# EasyEDA Pro project ProPrj_CWATCH_2025-07-30.epro, board PCB4
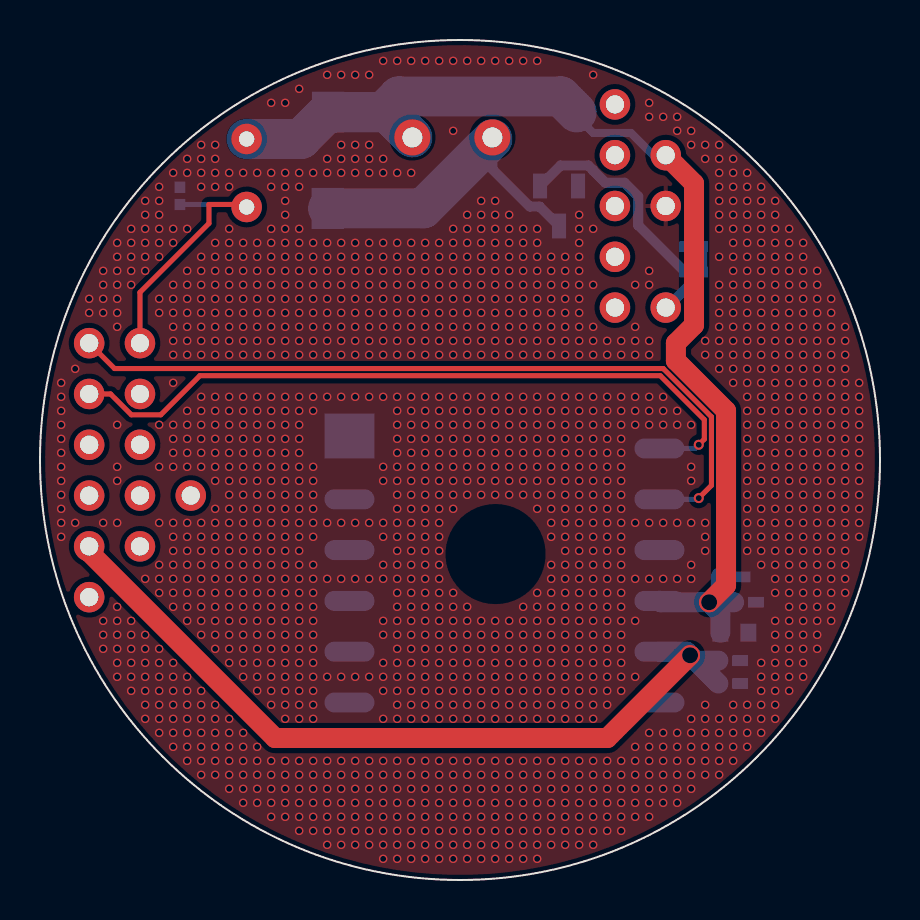
[diagram p7: board, top side]
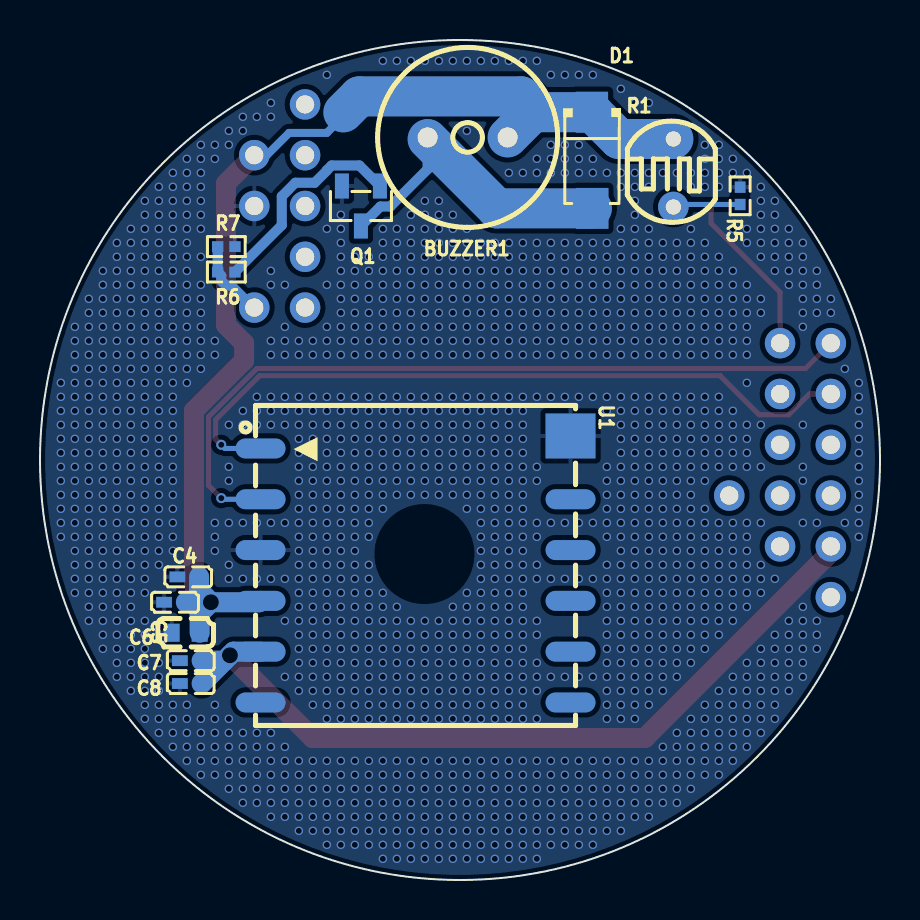
[diagram p8: board, bottom side, seen from below]

Outline 42 x 42 mm; copper layers: Top Layer, Bottom Layer. Coordinates in mm from the lower left corner of the outline.
Outline path: circle c21,21 r21
Stack: Top Layer 0.035mm / Dielectric1 1.51mm FR4 er 4.5 / Bottom Layer 0.035mm

## Design rules (mm)
template: Custom Config
spacing copperThickness1oz (default): track to track 0.102, other pairs 0.152 to 0.3
spacing copperThickness2oz: track to track 0.203, other pairs 0.152 to 0.3
track width copperThickness1oz (default): min 0.127, default 0.254, max 2.54
track width copperThickness2oz: min 0.203, default 0.254, max 2.54
differential pair differentialPair (default): width min 0.127, default 0.254, max 2.54; gap min 0.152, default 0.152
via viaSize (default): diameter min 0.4, default 0.5, max 10; hole min 0.3, default 0.305, max 6.3

## Placement (name value [footprint] x y rotation side)
BUZZER1  2.7kHz  [BUZ-TH_BD9.0-P4.00-D0.6-FD]  20.62 37.13 0 bottom
C4  1uF  [C0402]  34.59 15.16 180 bottom
C5  100nF  [C0402]  35.25 13.89 180 bottom
C6  10uF  [C0603]  34.72 12.36 180 bottom
C7  100nF  [C0402]  34.46 10.97 180 bottom
C8  4.7uF  [C0402]  34.46 9.82 180 bottom
D1  SS16  [SMA_L4.3-W2.6-LS5.0-RD]  14.4 35.99 270 bottom
NOREF  -  [Pad_e10]  2.46 19.22 0 top
NOREF#2  -  [Pad_e19]  28.75 33.7 0 top
NOREF#3  -  [Pad_e18]  28.75 31.16 0 top
NOREF#4  -  [Pad_e15]  5 21.76 0 top
NOREF#5  -  [Pad_e14]  5 19.22 0 top
NOREF#6  -  [Pad_e12]  2.46 14.14 0 top
NOREF#7  -  [Pad_e11]  2.46 16.68 0 top
NOREF#8  -  [Pad_e7]  2.46 26.84 0 top
NOREF#9  -  [Pad_e26]  31.29 28.62 0 top
NOREF#10  -  [Pad_e13]  5 16.68 0 top
NOREF#11  -  [Pad_e20]  28.75 36.24 0 top
NOREF#12  -  [Pad_e23]  31.29 33.7 0 top
NOREF#13  -  [Pad_e285]  5 26.84 0 top
NOREF#14  -  [Pad_e22]  31.29 36.24 0 top
NOREF#15  -  [Pad_e17]  28.75 28.62 0 top
NOREF#16  -  [Pad_e9]  2.46 21.76 0 top
NOREF#17  -  [Pad_e16]  5 24.3 0 top
NOREF#18  -  [Pad_e21]  28.75 38.78 0 top
NOREF#19  -  [Pad_e8]  2.46 24.3 0 top
NOREF#20  -  [Pad_e815]  7.54 19.22 0 top
Q1  SS8050(RANGE:200-350)  [SOT-23-3_L2.9-W1.3-P1.90-LS2.4-BR]  25.95 33.7 90 bottom
R1  GL5528  [RES-TH_L5.1-W4.3-P3.40-D0.5]  10.33 35.35 180 bottom
R5  10kΩ  [R0402]  6.99 34.21 90 bottom
R6  2.2kΩ  [R0402]  32.68 30.4 180 bottom
R7  10kΩ  [R0402]  32.68 31.67 180 bottom
U1  L80RE-M37  [GPSM-SMD_12P-L16.0-W16.0-P2.54-BL]  23.22 15.54 270 bottom

## Footprints (pads in the part's own frame, mm; a bottom-side part is the same pattern mirrored in y, then rotated)
BUZ-TH_BD9.0-P4.00-D0.6-FD
  round 1.8 hole 1: 1(-2,0) 2(2,0)
C0402
  rect 0.79x0.54 smd: 1(-0.545,0) 2(0.545,0)
C0603
  rect 0.8x0.9 smd: 1(-0.7,0) 2(0.7,0)
GPSM-SMD_12P-L16.0-W16.0-P2.54-BL
  oval 1x2.5 smd: 1(-6.037,-7.75) 2(-3.498,-7.75) 3(-0.958,-7.75) 4(1.583,-7.75) 5(4.122,-7.75) 6(6.662,-7.75) 7(6.662,7.75) 8(4.122,7.75) 9(1.583,7.75) 10(-0.958,7.75) 11(-3.498,7.75)
  rect 2.25x2.5 smd: 12(-6.662,7.75)
Pad_e7
  round 1.524 hole 0.914: 1(0,0)
Pad_e8
  round 1.524 hole 0.914: 2(0,0)
Pad_e9
  round 1.524 hole 0.914: 3(0,0)
Pad_e10
  round 1.524 hole 0.914: 4(0,0)
Pad_e11
  round 1.524 hole 0.914: 5(0,0)
Pad_e12
  round 1.524 hole 0.914: 6(0,0)
Pad_e13
  round 1.524 hole 0.914: 10(0,0)
Pad_e14
  round 1.524 hole 0.914: 9(0,0)
Pad_e15
  round 1.524 hole 0.914: 8(0,0)
Pad_e16
  round 1.524 hole 0.914: 7(0,0)
Pad_e17
  round 1.524 hole 0.914: 5(0,0)
Pad_e18
  round 1.524 hole 0.914: 4(0,0)
Pad_e19
  round 1.524 hole 0.914: 3(0,0)
Pad_e20
  round 1.524 hole 0.914: 2(0,0)
Pad_e21
  round 1.524 hole 0.914: 1(0,0)
Pad_e22
  round 1.524 hole 0.914: 6(0,0)
Pad_e23
  round 1.524 hole 0.914: 8(0,0)
Pad_e26
  round 1.524 hole 0.914: 5(0,0)
Pad_e285
  round 1.524 hole 0.914: 7(0,0)
Pad_e815
  round 1.524 hole 0.914: 9(0,0)
R0402
  rect 0.566x0.54 smd: 1(-0.433,0) 2(0.433,0)
RES-TH_L5.1-W4.3-P3.40-D0.5
  round 1.524 hole 0.762: 1(0,1.7) 2(0,-1.7)
SMA_L4.3-W2.6-LS5.0-RD
  rect 2.046x1.62 smd: 1(-2.404,-0.009) 2(2.404,0.009)
SOT-23-3_L2.9-W1.3-P1.90-LS2.4-BR
  rect 1.25x0.7 smd: 1(1,-0.95) 2(1,0.95) 3(-1,0)

## Nets
3.3V: BUZZER1.1 C4.2 C5.2 C6.2 D1.1 NOREF#14.6 R1.1 U1.4
GND: C4.1 C5.1 C6.1 C7.1 C8.1 NOREF#12.8 Q1.2 R5.2 R7.2 U1.3 U1.12
PGND: NOREF#6.6
BAT: C7.2 C8.2 NOREF#7.5 U1.5
BLA: NOREF#17.7
CSO: NOREF#3.4
DC: NOREF#15.5
IO4: NOREF#13.7 R1.2 R5.1
IO15: NOREF#9.5 R6.1 R7.1
IO16: NOREF#8.1 U1.2
IO17: NOREF#19.2 U1.1
IO35: NOREF#20.9
L_RST: NOREF#4.8
MISO: NOREF#18.1
MOSI: NOREF#11.2
SCK: NOREF#2.3
SCL: NOREF#10.10
SDA: NOREF#5.9
TP_INT: NOREF.4
TP_RST: NOREF#16.3
$1N970: BUZZER1.2 D1.2 Q1.3
$1N1589: Q1.1 R6.2

Pads without a net: U1 6 7 8 9 10 11

## Via types
v1: diameter 0.42, hole 0.3, Top Layer to Bottom Layer, 1648 vias
v2: diameter 0.5, hole 0.305, Top Layer to Bottom Layer, 2 vias
v3: diameter 1, hole 0.8, Top Layer to Bottom Layer, 2 vias

## Routing (per net, layer and track width the routed paths; a pad name or vN(x,y) marks a point on that pad's centre or on a via; arc(x,y) is an arc through that point)
3.3V: length 56.9
  Top Layer w1: v3(33.46,13.89) 34.3,14.73 34.3,23.46 31.79,25.97 31.79,26.84 32.7,27.75 32.7,34.83 NOREF#14.6
  Bottom Layer w0.4: 26.83,38.38 26.83,38.18 27.66,37.35 29.55,37.35 30.66,36.24 NOREF#14.6
  Bottom Layer w1: v3(33.46,13.89) 34.04,14.48 C4.2 ; v3(33.46,13.89) 34.02,13.33 C6.2 ; v3(33.46,13.89) C5.2 ; v3(33.46,13.89) 31.04,13.89 U1.4
  Bottom Layer w2: 17.15,38.39 14.39,38.39 13.05,37.05 R1.1 ; 17.15,38.39 17.36,38.39 BUZZER1.1 ; 17.15,38.39 17.94,39.18 26.03,39.18 26.83,38.38
GND:
  vias: v1(1.06,24.86) v1(1.06,24.16) v1(1.06,23.46) v1(1.06,22.76) v1(1.06,22.06) v1(1.06,21.36) v1(1.06,20.66) v1(1.06,19.96) v1(1.06,19.26) v1(1.06,18.56) v1(1.06,17.86) v1(1.06,17.16) v1(1.76,25.56) v1(1.76,17.86) v1(2.46,29.06) v1(2.46,28.36) v1(3.16,30.46) v1(3.16,29.76) v1(3.16,29.06) v1(3.16,28.36) v1(3.16,17.86) v1(3.16,12.96) v1(3.16,12.26) v1(3.16,11.56) v1(3.86,31.86) v1(3.86,31.16) v1(3.86,30.46) v1(3.86,29.76) v1(3.86,29.06) v1(3.86,28.36) v1(3.86,27.66) v1(3.86,22.76) v1(3.86,20.66) v1(3.86,19.96) v1(3.86,17.86) v1(3.86,13.66) v1(3.86,12.96) v1(3.86,12.26) v1(3.86,11.56) v1(3.86,10.86) v1(3.86,10.16) v1(4.56,32.56) v1(4.56,31.86) v1(4.56,31.16) v1(4.56,30.46) v1(4.56,29.76) v1(4.56,12.96) v1(4.56,12.26) v1(4.56,11.56) v1(4.56,10.86) v1(4.56,10.16) v1(4.56,9.46) v1(5.26,33.96) v1(5.26,33.26) v1(5.26,32.56) v1(5.26,31.86) v1(5.26,31.16) v1(5.26,30.46) v1(5.26,15.06) v1(5.26,12.26) v1(5.26,11.56) v1(5.26,10.86) v1(5.26,10.16) v1(5.26,9.46) v1(5.26,8.76) v1(5.26,8.06) v1(5.96,34.66) v1(5.96,33.96) v1(5.96,33.26) v1(5.96,32.56) v1(5.96,31.86) v1(5.96,31.16) v1(5.96,29.06) v1(5.96,28.36) v1(5.96,22.76) v1(5.96,20.66) v1(5.96,17.86) v1(5.96,15.76) v1(5.96,15.06) v1(5.96,14.36) v1(5.96,11.56) v1(5.96,10.86) v1(5.96,10.16) v1(5.96,9.46) v1(5.96,8.76) v1(5.96,8.06) v1(5.96,7.36) v1(6.66,35.36) v1(6.66,32.56) v1(6.66,31.86) v1(6.66,29.76) v1(6.66,29.06) v1(6.66,28.36) v1(6.66,27.66) v1(6.66,26.96) v1(6.66,26.26) v1(6.66,24.86) v1(6.66,22.76) v1(6.66,22.06) v1(6.66,21.36) v1(6.66,20.66) v1(6.66,17.86) v1(6.66,17.16) v1(6.66,16.46) v1(6.66,15.76) v1(6.66,15.06) v1(6.66,14.36) v1(6.66,13.66) v1(6.66,10.86) v1(6.66,10.16) v1(6.66,9.46) v1(6.66,8.76) v1(6.66,8.06) v1(6.66,7.36) v1(6.66,6.66) v1(7.36,36.06) v1(7.36,35.36) v1(7.36,32.56) v1(7.36,30.46) v1(7.36,29.76) v1(7.36,29.06) v1(7.36,28.36) v1(7.36,27.66) v1(7.36,26.96) v1(7.36,26.26) v1(7.36,23.46) v1(7.36,22.76) v1(7.36,22.06) v1(7.36,21.36) v1(7.36,20.66) v1(7.36,17.86) v1(7.36,17.16) v1(7.36,16.46) v1(7.36,15.76) v1(7.36,15.06) v1(7.36,14.36) v1(7.36,13.66) v1(7.36,12.96) v1(7.36,10.16) v1(7.36,9.46) v1(7.36,8.76) v1(7.36,8.06) v1(7.36,7.36) v1(7.36,6.66) v1(7.36,5.96) v1(8.06,36.76) v1(8.06,36.06) v1(8.06,35.36) v1(8.06,34.66) v1(8.06,31.16) v1(8.06,30.46) v1(8.06,29.76) v1(8.06,29.06) v1(8.06,28.36) v1(8.06,27.66) v1(8.06,26.96) v1(8.06,26.26) v1(8.06,24.16) v1(8.06,23.46) v1(8.06,22.76) v1(8.06,22.06) v1(8.06,21.36) v1(8.06,20.66) v1(8.06,17.86) v1(8.06,17.16) v1(8.06,16.46) v1(8.06,15.76) v1(8.06,15.06) v1(8.06,14.36) v1(8.06,13.66) v1(8.06,12.96) v1(8.06,12.26) v1(8.06,9.46) v1(8.06,8.76) v1(8.06,8.06) v1(8.06,7.36) v1(8.06,6.66) v1(8.06,5.96) v1(8.06,5.26) v1(8.76,36.76) v1(8.76,36.06) v1(8.76,35.36) v1(8.76,34.66) v1(8.76,31.86) v1(8.76,31.16) v1(8.76,30.46) v1(8.76,29.76) v1(8.76,29.06) v1(8.76,28.36) v1(8.76,27.66) v1(8.76,26.96) v1(8.76,26.26) v1(8.76,24.16) v1(8.76,23.46) v1(8.76,22.76) v1(8.76,22.06) v1(8.76,21.36) v1(8.76,20.66) v1(8.76,19.96) v1(8.76,18.56) v1(8.76,17.86) v1(8.76,17.16) v1(8.76,16.46) v1(8.76,15.76) v1(8.76,15.06) v1(8.76,14.36) v1(8.76,13.66) v1(8.76,12.96) v1(8.76,12.26) v1(8.76,11.56) v1(8.76,8.76) v1(8.76,8.06) v1(8.76,7.36) v1(8.76,6.66) v1(8.76,5.96) v1(8.76,5.26) v1(9.46,35.36) v1(9.46,34.66) v1(9.46,32.56) v1(9.46,31.86) v1(9.46,31.16) v1(9.46,30.46) v1(9.46,29.76) v1(9.46,29.06) v1(9.46,28.36) v1(9.46,27.66) v1(9.46,26.96) v1(9.46,26.26) v1(9.46,24.16) v1(9.46,23.46) v1(9.46,22.76) v1(9.46,22.06) v1(9.46,21.36) v1(9.46,20.66) v1(9.46,19.96) v1(9.46,19.26) v1(9.46,18.56) v1(9.46,17.86) v1(9.46,17.16) v1(9.46,16.46) v1(9.46,15.76) v1(9.46,15.06) v1(9.46,14.36) v1(9.46,13.66) v1(9.46,12.96) v1(9.46,12.26) v1(9.46,11.56) v1(9.46,10.86) v1(9.46,8.06) v1(9.46,7.36) v1(9.46,6.66) v1(9.46,5.96) v1(9.46,5.26) v1(9.46,4.56) v1(10.16,35.36) v1(10.16,31.86) v1(10.16,31.16) v1(10.16,30.46) v1(10.16,29.76) v1(10.16,29.06) v1(10.16,28.36) v1(10.16,27.66) v1(10.16,26.96) v1(10.16,26.26) v1(10.16,24.16) v1(10.16,23.46) v1(10.16,22.76) v1(10.16,22.06) v1(10.16,21.36) v1(10.16,20.66) v1(10.16,19.96) v1(10.16,19.26) v1(10.16,18.56) v1(10.16,17.86) v1(10.16,17.16) v1(10.16,16.46) v1(10.16,15.76) v1(10.16,15.06) v1(10.16,14.36) v1(10.16,13.66) v1(10.16,12.96) v1(10.16,12.26) v1(10.16,11.56) v1(10.16,10.86) v1(10.16,10.16) v1(10.16,7.36) v1(10.16,6.66) v1(10.16,5.96) v1(10.16,5.26) v1(10.16,4.56) v1(10.16,3.86) v1(10.86,35.36) v1(10.86,31.86) v1(10.86,31.16) v1(10.86,30.46) v1(10.86,29.76) v1(10.86,29.06) v1(10.86,28.36) v1(10.86,27.66) v1(10.86,26.96) v1(10.86,26.26) v1(10.86,24.16) v1(10.86,23.46) v1(10.86,22.76) v1(10.86,22.06) v1(10.86,21.36) v1(10.86,20.66) v1(10.86,19.96) v1(10.86,19.26) v1(10.86,18.56) v1(10.86,17.86) v1(10.86,17.16) v1(10.86,16.46) v1(10.86,15.76) v1(10.86,15.06) v1(10.86,14.36) v1(10.86,13.66) v1(10.86,12.96) v1(10.86,12.26) v1(10.86,11.56) v1(10.86,10.86) v1(10.86,10.16) v1(10.86,9.46) v1(10.86,6.66) v1(10.86,5.96) v1(10.86,5.26) v1(10.86,4.56) v1(10.86,3.86) v1(11.56,38.86) v1(11.56,35.36) v1(11.56,34.66) v1(11.56,32.56) v1(11.56,31.86) v1(11.56,31.16) v1(11.56,30.46) v1(11.56,29.76) v1(11.56,29.06) v1(11.56,28.36) v1(11.56,27.66) v1(11.56,26.96) v1(11.56,26.26) v1(11.56,24.16) v1(11.56,23.46) v1(11.56,22.76) v1(11.56,22.06) v1(11.56,21.36) v1(11.56,20.66) v1(11.56,19.96) v1(11.56,19.26) v1(11.56,18.56) v1(11.56,17.86) v1(11.56,17.16) v1(11.56,16.46) v1(11.56,15.76) v1(11.56,15.06) v1(11.56,14.36) v1(11.56,13.66) v1(11.56,12.96) v1(11.56,12.26) v1(11.56,11.56) v1(11.56,10.86) v1(11.56,10.16) v1(11.56,9.46) v1(11.56,8.76) v1(11.56,5.96) v1(11.56,5.26) v1(11.56,4.56) v1(11.56,3.86) v1(11.56,3.16) v1(12.26,38.86) v1(12.26,35.36) v1(12.26,34.66) v1(12.26,33.96) v1(12.26,33.26) v1(12.26,32.56) v1(12.26,31.86) v1(12.26,31.16) v1(12.26,30.46) v1(12.26,29.76) v1(12.26,29.06) v1(12.26,28.36) v1(12.26,27.66) v1(12.26,26.96) v1(12.26,26.26) v1(12.26,24.16) v1(12.26,23.46) v1(12.26,22.76) v1(12.26,22.06) v1(12.26,21.36) v1(12.26,20.66) v1(12.26,19.96) v1(12.26,19.26) v1(12.26,18.56) v1(12.26,17.86) v1(12.26,17.16) v1(12.26,16.46) v1(12.26,15.76) v1(12.26,15.06) v1(12.26,14.36) v1(12.26,13.66) v1(12.26,12.96) v1(12.26,12.26) v1(12.26,11.56) v1(12.26,10.86) v1(12.26,10.16) v1(12.26,9.46) v1(12.26,8.76) v1(12.26,8.06) v1(12.26,5.96) v1(12.26,5.26) v1(12.26,4.56) v1(12.26,3.86) v1(12.26,3.16) v1(12.96,39.56) v1(12.96,35.36) v1(12.96,34.66) v1(12.96,32.56) v1(12.96,31.86) v1(12.96,31.16) v1(12.96,30.46) v1(12.96,29.76) v1(12.96,29.06) v1(12.96,28.36) v1(12.96,27.66) v1(12.96,26.96) v1(12.96,26.26) v1(12.96,24.16) v1(12.96,23.46) v1(12.96,22.76) v1(12.96,22.06) v1(12.96,21.36) v1(12.96,20.66) v1(12.96,19.96) v1(12.96,19.26) v1(12.96,18.56) v1(12.96,17.86) v1(12.96,17.16) v1(12.96,16.46) v1(12.96,15.76) v1(12.96,15.06) v1(12.96,14.36) v1(12.96,13.66) v1(12.96,12.96) v1(12.96,12.26) v1(12.96,11.56) v1(12.96,10.86) v1(12.96,10.16) v1(12.96,9.46) v1(12.96,8.76) v1(12.96,8.06) v1(12.96,5.96) v1(12.96,5.26) v1(12.96,4.56) v1(12.96,3.86) v1(12.96,3.16) v1(12.96,2.46) v1(13.66,35.36) v1(13.66,31.86) v1(13.66,31.16) v1(13.66,30.46) v1(13.66,29.76) v1(13.66,29.06) v1(13.66,28.36) v1(13.66,27.66) v1(13.66,26.96) v1(13.66,26.26) v1(13.66,24.16) v1(13.66,23.46) v1(13.66,20.66) v1(13.66,19.96) v1(13.66,19.26) v1(13.66,18.56) v1(13.66,17.86) v1(13.66,17.16) v1(13.66,15.76) v1(13.66,15.06) v1(13.66,14.36) v1(13.66,13.66) v1(13.66,12.96) v1(13.66,12.26) v1(13.66,11.56) v1(13.66,10.86) v1(13.66,10.16) v1(13.66,9.46) v1(13.66,8.76) v1(13.66,8.06) v1(13.66,5.96) v1(13.66,5.26) v1(13.66,4.56) v1(13.66,3.86) v1(13.66,3.16) v1(13.66,2.46) v1(14.36,40.26) v1(14.36,36.06) v1(14.36,35.36) v1(14.36,31.86) v1(14.36,31.16) v1(14.36,30.46) v1(14.36,29.76) v1(14.36,29.06) v1(14.36,28.36) v1(14.36,27.66) v1(14.36,26.96) v1(14.36,26.26) v1(14.36,24.16) v1(14.36,17.86) v1(14.36,15.06) v1(14.36,10.16) v1(14.36,5.96) v1(14.36,5.26) v1(14.36,4.56) v1(14.36,3.86) v1(14.36,3.16) v1(14.36,2.46) v1(14.36,1.76) v1(15.06,40.26) v1(15.06,36.76) v1(15.06,36.06) v1(15.06,35.36) v1(15.06,31.86) v1(15.06,31.16) v1(15.06,30.46) v1(15.06,29.76) v1(15.06,29.06) v1(15.06,28.36) v1(15.06,27.66) v1(15.06,26.96) v1(15.06,26.26) v1(15.06,24.16) v1(15.06,17.86) v1(15.06,15.06) v1(15.06,10.16) v1(15.06,5.96) v1(15.06,5.26) v1(15.06,4.56) v1(15.06,3.86) v1(15.06,3.16) v1(15.06,2.46) v1(15.06,1.76) v1(15.76,40.26) v1(15.76,36.76) v1(15.76,36.06) v1(15.76,35.36) v1(15.76,31.86) v1(15.76,31.16) v1(15.76,30.46) v1(15.76,29.76) v1(15.76,29.06) v1(15.76,28.36) v1(15.76,27.66) v1(15.76,26.96) v1(15.76,26.26) v1(15.76,24.16) v1(15.76,17.86) v1(15.76,15.06) v1(15.76,10.16) v1(15.76,5.96) v1(15.76,5.26) v1(15.76,4.56) v1(15.76,3.86) v1(15.76,3.16) v1(15.76,2.46) v1(15.76,1.76) v1(16.46,40.26) v1(16.46,36.76) v1(16.46,36.06) v1(16.46,35.36) v1(16.46,31.86) v1(16.46,31.16) v1(16.46,30.46) v1(16.46,29.76) v1(16.46,29.06) v1(16.46,28.36) v1(16.46,27.66) v1(16.46,26.96) v1(16.46,26.26) v1(16.46,24.16) v1(16.46,17.86) v1(16.46,15.06) v1(16.46,10.16) v1(16.46,5.96) v1(16.46,5.26) v1(16.46,4.56) v1(16.46,3.86) v1(16.46,3.16) v1(16.46,2.46) v1(16.46,1.76) v1(17.16,40.96) v1(17.16,36.06) v1(17.16,35.36) v1(17.16,31.86) v1(17.16,31.16) v1(17.16,30.46) v1(17.16,29.76) v1(17.16,29.06) v1(17.16,28.36) v1(17.16,27.66) v1(17.16,26.96) v1(17.16,26.26) v1(17.16,24.16) v1(17.16,20.66) v1(17.16,19.96) v1(17.16,17.86) v1(17.16,17.16) v1(17.16,15.76) v1(17.16,15.06) v1(17.16,12.96) v1(17.16,12.26) v1(17.16,10.86) v1(17.16,10.16) v1(17.16,9.46) v1(17.16,8.06) v1(17.16,5.96) v1(17.16,5.26) v1(17.16,4.56) v1(17.16,3.86) v1(17.16,3.16) v1(17.16,2.46) v1(17.16,1.76) v1(17.16,1.06) v1(17.86,40.96) v1(17.86,35.36) v1(17.86,31.86) v1(17.86,31.16) v1(17.86,30.46) v1(17.86,29.76) v1(17.86,29.06) v1(17.86,28.36) v1(17.86,27.66) v1(17.86,26.96) v1(17.86,26.26) v1(17.86,24.16) v1(17.86,23.46) v1(17.86,22.76) v1(17.86,22.06) v1(17.86,21.36) v1(17.86,20.66) v1(17.86,19.96) v1(17.86,19.26) v1(17.86,18.56) v1(17.86,17.86) v1(17.86,17.16) v1(17.86,16.46) v1(17.86,15.76) v1(17.86,15.06) v1(17.86,14.36) v1(17.86,13.66) v1(17.86,12.96) v1(17.86,12.26) v1(17.86,11.56) v1(17.86,10.86) v1(17.86,10.16) v1(17.86,9.46) v1(17.86,8.76) v1(17.86,8.06) v1(17.86,5.96) v1(17.86,5.26) v1(17.86,4.56) v1(17.86,3.86) v1(17.86,3.16) v1(17.86,2.46) v1(17.86,1.76) v1(17.86,1.06) v1(18.56,40.96) v1(18.56,35.36) v1(18.56,31.86) v1(18.56,31.16) v1(18.56,30.46) v1(18.56,29.76) v1(18.56,29.06) v1(18.56,28.36) v1(18.56,27.66) v1(18.56,26.96) v1(18.56,26.26) v1(18.56,24.16) v1(18.56,23.46) v1(18.56,22.76) v1(18.56,22.06) v1(18.56,21.36) v1(18.56,20.66) v1(18.56,19.96) v1(18.56,19.26) v1(18.56,18.56) v1(18.56,17.86) v1(18.56,17.16) v1(18.56,16.46) v1(18.56,15.76) v1(18.56,15.06) v1(18.56,14.36) v1(18.56,13.66) v1(18.56,12.96) v1(18.56,12.26) v1(18.56,11.56) v1(18.56,10.86) v1(18.56,10.16) v1(18.56,9.46) v1(18.56,8.76) v1(18.56,8.06) v1(18.56,5.96) v1(18.56,5.26) v1(18.56,4.56) v1(18.56,3.86) v1(18.56,3.16) v1(18.56,2.46) v1(18.56,1.76) v1(18.56,1.06) v1(19.26,40.96) v1(19.26,31.86) v1(19.26,31.16) v1(19.26,30.46) v1(19.26,29.76) v1(19.26,29.06) v1(19.26,28.36) v1(19.26,27.66) v1(19.26,26.96) v1(19.26,26.26) v1(19.26,24.16) v1(19.26,23.46) v1(19.26,22.76) v1(19.26,22.06) v1(19.26,21.36) v1(19.26,20.66) v1(19.26,19.96) v1(19.26,19.26) v1(19.26,18.56) v1(19.26,17.86) v1(19.26,17.16) v1(19.26,16.46) v1(19.26,15.76) v1(19.26,15.06) v1(19.26,14.36) v1(19.26,13.66) v1(19.26,12.96) v1(19.26,12.26) v1(19.26,11.56) v1(19.26,10.86) v1(19.26,10.16) v1(19.26,9.46) v1(19.26,8.76) v1(19.26,8.06) v1(19.26,5.96) v1(19.26,5.26) v1(19.26,4.56) v1(19.26,3.86) v1(19.26,3.16) v1(19.26,2.46) v1(19.26,1.76) v1(19.26,1.06) v1(19.96,40.96) v1(19.96,31.86) v1(19.96,31.16) v1(19.96,30.46) v1(19.96,29.76) v1(19.96,29.06) v1(19.96,28.36) v1(19.96,27.66) v1(19.96,26.96) v1(19.96,26.26) v1(19.96,24.16) v1(19.96,23.46) v1(19.96,22.76) v1(19.96,22.06) v1(19.96,21.36) v1(19.96,20.66) v1(19.96,19.96) v1(19.96,19.26) v1(19.96,18.56) v1(19.96,17.86) v1(19.96,17.16) v1(19.96,16.46) v1(19.96,15.76) v1(19.96,15.06) v1(19.96,14.36) v1(19.96,13.66) v1(19.96,12.96) v1(19.96,12.26) v1(19.96,11.56) v1(19.96,10.86) v1(19.96,10.16) v1(19.96,9.46) v1(19.96,8.76) v1(19.96,8.06) v1(19.96,5.96) v1(19.96,5.26) v1(19.96,4.56) v1(19.96,3.86) v1(19.96,3.16) v1(19.96,2.46) v1(19.96,1.76) v1(19.96,1.06) v1(20.66,40.96) v1(20.66,37.46) v1(20.66,32.56) v1(20.66,31.86) v1(20.66,31.16) v1(20.66,30.46) v1(20.66,29.76) v1(20.66,29.06) v1(20.66,28.36) v1(20.66,27.66) v1(20.66,26.96) v1(20.66,26.26) v1(20.66,24.16) v1(20.66,23.46) v1(20.66,22.76) v1(20.66,22.06) v1(20.66,21.36) v1(20.66,20.66) v1(20.66,19.96) v1(20.66,19.26) v1(20.66,18.56) v1(20.66,14.36) v1(20.66,13.66) v1(20.66,12.96) v1(20.66,12.26) v1(20.66,11.56) v1(20.66,10.86) v1(20.66,10.16) v1(20.66,9.46) v1(20.66,8.76) v1(20.66,8.06) v1(20.66,5.96) v1(20.66,5.26) v1(20.66,4.56) v1(20.66,3.86) v1(20.66,3.16) v1(20.66,2.46) v1(20.66,1.76) v1(20.66,1.06) v1(21.36,40.96) v1(21.36,33.26) v1(21.36,32.56) v1(21.36,31.86) v1(21.36,31.16) v1(21.36,30.46) v1(21.36,29.76) v1(21.36,29.06) v1(21.36,28.36) v1(21.36,27.66) v1(21.36,26.96) v1(21.36,26.26) v1(21.36,24.16) v1(21.36,23.46) v1(21.36,22.76) v1(21.36,22.06) v1(21.36,21.36) v1(21.36,20.66) v1(21.36,19.96) v1(21.36,19.26) v1(21.36,13.66) v1(21.36,12.96) v1(21.36,12.26) v1(21.36,11.56) v1(21.36,10.86) v1(21.36,10.16) v1(21.36,9.46) v1(21.36,8.76) v1(21.36,8.06) v1(21.36,5.96) v1(21.36,5.26) v1(21.36,4.56) v1(21.36,3.86) v1(21.36,3.16) v1(21.36,2.46) v1(21.36,1.76) v1(21.36,1.06) v1(22.06,40.96) v1(22.06,33.96) v1(22.06,33.26) v1(22.06,32.56) v1(22.06,31.86) v1(22.06,31.16) v1(22.06,30.46) v1(22.06,29.76) v1(22.06,29.06) v1(22.06,28.36) v1(22.06,27.66) v1(22.06,26.96) v1(22.06,26.26) v1(22.06,24.16) v1(22.06,23.46) v1(22.06,22.76) v1(22.06,22.06) v1(22.06,21.36) v1(22.06,20.66) v1(22.06,19.96) v1(22.06,19.26) v1(22.06,12.96) v1(22.06,12.26) v1(22.06,11.56) v1(22.06,10.86) v1(22.06,10.16) v1(22.06,9.46) v1(22.06,8.76) v1(22.06,8.06) v1(22.06,5.96) v1(22.06,5.26) v1(22.06,4.56) v1(22.06,3.86) v1(22.06,3.16) v1(22.06,2.46) v1(22.06,1.76) v1(22.06,1.06) v1(22.76,40.96) v1(22.76,33.96) v1(22.76,33.26) v1(22.76,32.56) v1(22.76,31.86) v1(22.76,31.16) v1(22.76,30.46) v1(22.76,29.76) v1(22.76,29.06) v1(22.76,28.36) v1(22.76,27.66) v1(22.76,26.96) v1(22.76,26.26) v1(22.76,24.16) v1(22.76,23.46) v1(22.76,22.76) v1(22.76,22.06) v1(22.76,21.36) v1(22.76,20.66) v1(22.76,19.96) v1(22.76,19.26) v1(22.76,12.96) v1(22.76,12.26) v1(22.76,11.56) v1(22.76,10.86) v1(22.76,10.16) v1(22.76,9.46) v1(22.76,8.76) v1(22.76,8.06) v1(22.76,5.96) v1(22.76,5.26) v1(22.76,4.56) v1(22.76,3.86) v1(22.76,3.16) v1(22.76,2.46) v1(22.76,1.76) v1(22.76,1.06) v1(23.46,40.96) v1(23.46,33.26) v1(23.46,32.56) v1(23.46,31.86) v1(23.46,31.16) v1(23.46,30.46) v1(23.46,29.76) v1(23.46,29.06) v1(23.46,28.36) v1(23.46,27.66) v1(23.46,26.96) v1(23.46,26.26) v1(23.46,24.16) v1(23.46,23.46) v1(23.46,22.76) v1(23.46,22.06) v1(23.46,21.36) v1(23.46,20.66) v1(23.46,19.96) v1(23.46,19.26) v1(23.46,12.96) v1(23.46,12.26) v1(23.46,11.56) v1(23.46,10.86) v1(23.46,10.16) v1(23.46,9.46) v1(23.46,8.76) v1(23.46,8.06) v1(23.46,5.96) v1(23.46,5.26) v1(23.46,4.56) v1(23.46,3.86) v1(23.46,3.16) v1(23.46,2.46) v1(23.46,1.76) v1(23.46,1.06) v1(24.16,40.96) v1(24.16,32.56) v1(24.16,31.86) v1(24.16,31.16) v1(24.16,30.46) v1(24.16,29.76) v1(24.16,29.06) v1(24.16,28.36) v1(24.16,27.66) v1(24.16,26.96) v1(24.16,26.26) v1(24.16,24.16) v1(24.16,23.46) v1(24.16,22.76) v1(24.16,22.06) v1(24.16,21.36) v1(24.16,20.66) v1(24.16,19.96) v1(24.16,19.26) v1(24.16,13.66) v1(24.16,12.96) v1(24.16,12.26) v1(24.16,11.56) v1(24.16,10.86) v1(24.16,10.16) v1(24.16,9.46) v1(24.16,8.76) v1(24.16,8.06) v1(24.16,5.96) v1(24.16,5.26) v1(24.16,4.56) v1(24.16,3.86) v1(24.16,3.16) v1(24.16,2.46) v1(24.16,1.76) v1(24.16,1.06) v1(24.86,40.96) v1(24.86,32.56) v1(24.86,31.86) v1(24.86,31.16) v1(24.86,30.46) v1(24.86,29.76) v1(24.86,29.06) v1(24.86,28.36) v1(24.86,27.66) v1(24.86,26.96) v1(24.86,26.26) v1(24.86,24.16) v1(24.86,23.46) v1(24.86,22.76) v1(24.86,22.06) v1(24.86,21.36) v1(24.86,20.66) v1(24.86,19.96) v1(24.86,19.26) v1(24.86,18.56) v1(24.86,14.36) v1(24.86,13.66) v1(24.86,12.96) v1(24.86,12.26) v1(24.86,11.56) v1(24.86,10.86) v1(24.86,10.16) v1(24.86,9.46) v1(24.86,8.76) v1(24.86,8.06) v1(24.86,5.96) v1(24.86,5.26) v1(24.86,4.56) v1(24.86,3.86) v1(24.86,3.16) v1(24.86,2.46) v1(24.86,1.76) v1(24.86,1.06) v1(25.56,31.16) v1(25.56,30.46) v1(25.56,29.76) v1(25.56,29.06) v1(25.56,28.36) v1(25.56,27.66) v1(25.56,26.96) v1(25.56,26.26) v1(25.56,24.16) v1(25.56,23.46) v1(25.56,22.76) v1(25.56,22.06) v1(25.56,21.36) v1(25.56,20.66) v1(25.56,19.96) v1(25.56,19.26) v1(25.56,18.56) v1(25.56,17.86) v1(25.56,17.16) v1(25.56,15.76) v1(25.56,15.06) v1(25.56,14.36) v1(25.56,13.66) v1(25.56,12.96) v1(25.56,12.26) v1(25.56,11.56) v1(25.56,10.86) v1(25.56,10.16) v1(25.56,9.46) v1(25.56,8.76) v1(25.56,8.06) v1(25.56,5.96) v1(25.56,5.26) v1(25.56,4.56) v1(25.56,3.86) v1(25.56,3.16) v1(25.56,2.46) v1(25.56,1.76) v1(26.26,31.16) v1(26.26,30.46) v1(26.26,29.76) v1(26.26,29.06) v1(26.26,28.36) v1(26.26,27.66) v1(26.26,26.96) v1(26.26,26.26) v1(26.26,24.16) v1(26.26,23.46) v1(26.26,22.76) v1(26.26,22.06) v1(26.26,21.36) v1(26.26,20.66) v1(26.26,19.96) v1(26.26,19.26) v1(26.26,18.56) v1(26.26,17.86) v1(26.26,17.16) v1(26.26,16.46) v1(26.26,15.76) v1(26.26,15.06) v1(26.26,14.36) v1(26.26,13.66) v1(26.26,12.96) v1(26.26,12.26) v1(26.26,11.56) v1(26.26,10.86) v1(26.26,10.16) v1(26.26,9.46) v1(26.26,8.76) v1(26.26,8.06) v1(26.26,5.96) v1(26.26,5.26) v1(26.26,4.56) v1(26.26,3.86) v1(26.26,3.16) v1(26.26,2.46) v1(26.26,1.76) v1(26.96,33.26) v1(26.96,32.56) v1(26.96,31.86) v1(26.96,31.16) v1(26.96,30.46) v1(26.96,29.76) v1(26.96,29.06) v1(26.96,28.36) v1(26.96,27.66) v1(26.96,26.96) v1(26.96,26.26) v1(26.96,24.16) v1(26.96,23.46) v1(26.96,22.76) v1(26.96,22.06) v1(26.96,21.36) v1(26.96,20.66) v1(26.96,19.96) v1(26.96,19.26) v1(26.96,18.56) v1(26.96,17.86) v1(26.96,17.16) v1(26.96,16.46) v1(26.96,15.76) v1(26.96,15.06) v1(26.96,14.36) v1(26.96,13.66) v1(26.96,12.96) v1(26.96,12.26) v1(26.96,11.56) v1(26.96,10.86) v1(26.96,10.16) v1(26.96,9.46) v1(26.96,8.76) v1(26.96,8.06) v1(26.96,5.96) v1(26.96,5.26) v1(26.96,4.56) v1(26.96,3.86) v1(26.96,3.16) v1(26.96,2.46) v1(26.96,1.76) v1(27.66,40.26) v1(27.66,32.56) v1(27.66,29.76) v1(27.66,27.66) v1(27.66,26.96) v1(27.66,26.26) v1(27.66,24.16) v1(27.66,23.46) v1(27.66,22.76) v1(27.66,22.06) v1(27.66,21.36) v1(27.66,20.66) v1(27.66,19.96) v1(27.66,19.26) v1(27.66,18.56) v1(27.66,17.86) v1(27.66,17.16) v1(27.66,16.46) v1(27.66,15.76) v1(27.66,15.06) v1(27.66,14.36) v1(27.66,13.66) v1(27.66,12.96) v1(27.66,12.26) v1(27.66,11.56) v1(27.66,10.86) v1(27.66,10.16) v1(27.66,9.46) v1(27.66,8.76) v1(27.66,8.06) v1(27.66,5.96) v1(27.66,5.26) v1(27.66,4.56) v1(27.66,3.86) v1(27.66,3.16) v1(27.66,2.46) v1(27.66,1.76) v1(28.36,26.96) v1(28.36,26.26) v1(28.36,24.16) v1(28.36,23.46) v1(28.36,22.76) v1(28.36,22.06) v1(28.36,21.36) v1(28.36,20.66) v1(28.36,19.96) v1(28.36,19.26) v1(28.36,18.56) v1(28.36,17.86) v1(28.36,17.16) v1(28.36,16.46) v1(28.36,15.76) v1(28.36,15.06) v1(28.36,14.36) v1(28.36,13.66) v1(28.36,12.96) v1(28.36,12.26) v1(28.36,11.56) v1(28.36,10.86) v1(28.36,10.16) v1(28.36,9.46) v1(28.36,8.76) v1(28.36,5.96) v1(28.36,5.26) v1(28.36,4.56) v1(28.36,3.86) v1(28.36,3.16) v1(28.36,2.46) v1(29.06,26.96) v1(29.06,26.26) v1(29.06,24.16) v1(29.06,23.46) v1(29.06,22.76) v1(29.06,22.06) v1(29.06,21.36) v1(29.06,20.66) v1(29.06,19.96) v1(29.06,19.26) v1(29.06,18.56) v1(29.06,17.86) v1(29.06,17.16) v1(29.06,16.46) v1(29.06,15.76) v1(29.06,15.06) v1(29.06,14.36) v1(29.06,13.66) v1(29.06,12.96) v1(29.06,12.26) v1(29.06,11.56) v1(29.06,10.86) v1(29.06,10.16) v1(29.06,9.46) v1(29.06,5.96) v1(29.06,5.26) v1(29.06,4.56) v1(29.06,3.86) v1(29.06,3.16) v1(29.06,2.46) v1(29.76,29.76) v1(29.76,27.66) v1(29.76,26.96) v1(29.76,26.26) v1(29.76,24.16) v1(29.76,23.46) v1(29.76,22.76) v1(29.76,17.86) v1(29.76,15.06) v1(29.76,12.96) v1(29.76,10.16) v1(29.76,6.66) v1(29.76,5.96) v1(29.76,5.26) v1(29.76,4.56) v1(29.76,3.86) v1(29.76,3.16) v1(30.46,38.86) v1(30.46,38.16) v1(30.46,30.46) v1(30.46,29.76) v1(30.46,26.96) v1(30.46,26.26) v1(30.46,24.16) v1(30.46,23.46) v1(30.46,22.76) v1(30.46,17.86) v1(30.46,15.06) v1(30.46,7.36) v1(30.46,6.66) v1(30.46,5.96) v1(30.46,5.26) v1(30.46,4.56) v1(30.46,3.86) v1(30.46,3.16) v1(31.16,38.16) v1(31.16,24.16) v1(31.16,23.46) v1(31.16,22.76) v1(31.16,17.86) v1(31.16,15.06) v1(31.16,7.36) v1(31.16,6.66) v1(31.16,5.96) v1(31.16,5.26) v1(31.16,4.56) v1(31.16,3.86) v1(31.86,38.16) v1(31.86,37.46) v1(31.86,23.46) v1(31.86,22.76) v1(31.86,17.86) v1(31.86,15.06) v1(31.86,7.36) v1(31.86,6.66) v1(31.86,5.96) v1(31.86,5.26) v1(31.86,4.56) v1(31.86,3.86) v1(32.56,37.46) v1(32.56,36.76) v1(32.56,22.76) v1(32.56,20.66) v1(32.56,19.96) v1(32.56,17.86) v1(32.56,15.76) v1(32.56,15.06) v1(32.56,8.06) v1(32.56,7.36) v1(32.56,6.66) v1(32.56,5.96) v1(32.56,5.26) v1(32.56,4.56) v1(33.26,36.76) v1(33.26,36.06) v1(33.26,26.96) v1(33.26,26.26) v1(33.26,17.86) v1(33.26,17.16) v1(33.26,16.46) v1(33.26,8.76) v1(33.26,8.06) v1(33.26,7.36) v1(33.26,6.66) v1(33.26,5.96) v1(33.26,5.26) v1(33.96,36.76) v1(33.96,36.06) v1(33.96,35.36) v1(33.96,34.66) v1(33.96,33.96) v1(33.96,33.26) v1(33.96,32.56) v1(33.96,31.16) v1(33.96,29.76) v1(33.96,29.06) v1(33.96,28.36) v1(33.96,27.66) v1(33.96,26.96) v1(33.96,26.26) v1(33.96,25.56) v1(33.96,8.06) v1(33.96,7.36) v1(33.96,6.66) v1(33.96,5.96) v1(33.96,5.26) v1(34.66,36.06) v1(34.66,35.36) v1(34.66,34.66) v1(34.66,33.96) v1(34.66,33.26) v1(34.66,32.56) v1(34.66,31.86) v1(34.66,31.16) v1(34.66,30.46) v1(34.66,29.76) v1(34.66,29.06) v1(34.66,28.36) v1(34.66,27.66) v1(34.66,26.96) v1(34.66,26.26) v1(34.66,25.56) v1(34.66,24.86) v1(34.66,8.76) v1(34.66,8.06) v1(34.66,7.36) v1(34.66,6.66) v1(34.66,5.96) v1(35.36,35.36) v1(35.36,34.66) v1(35.36,33.96) v1(35.36,33.26) v1(35.36,32.56) v1(35.36,31.86) v1(35.36,31.16) v1(35.36,30.46) v1(35.36,29.76) v1(35.36,29.06) v1(35.36,28.36) v1(35.36,27.66) v1(35.36,26.96) v1(35.36,26.26) v1(35.36,25.56) v1(35.36,24.86) v1(35.36,24.16) v1(35.36,23.46) v1(35.36,22.76) v1(35.36,22.06) v1(35.36,21.36) v1(35.36,20.66) v1(35.36,19.96) v1(35.36,19.26) v1(35.36,18.56) v1(35.36,17.86) v1(35.36,17.16) v1(35.36,16.46) v1(35.36,8.76) v1(35.36,8.06) v1(35.36,7.36) v1(35.36,6.66) v1(36.06,34.66) v1(36.06,33.96) v1(36.06,33.26) v1(36.06,32.56) v1(36.06,31.86) v1(36.06,31.16) v1(36.06,30.46) v1(36.06,29.76) v1(36.06,29.06) v1(36.06,28.36) v1(36.06,27.66) v1(36.06,26.96) v1(36.06,26.26) v1(36.06,25.56) v1(36.06,24.86) v1(36.06,24.16) v1(36.06,23.46) v1(36.06,22.76) v1(36.06,22.06) v1(36.06,21.36) v1(36.06,20.66) v1(36.06,19.96) v1(36.06,19.26) v1(36.06,18.56) v1(36.06,17.86) v1(36.06,17.16) v1(36.06,16.46) v1(36.06,15.76) v1(36.06,10.86) v1(36.06,10.16) v1(36.06,9.46) v1(36.06,8.76) v1(36.06,8.06) v1(36.06,7.36) v1(36.76,33.96) v1(36.76,33.26) v1(36.76,32.56) v1(36.76,31.86) v1(36.76,31.16) v1(36.76,30.46) v1(36.76,29.76) v1(36.76,29.06) v1(36.76,28.36) v1(36.76,27.66) v1(36.76,26.96) v1(36.76,26.26) v1(36.76,25.56) v1(36.76,24.86) v1(36.76,24.16) v1(36.76,23.46) v1(36.76,22.76) v1(36.76,22.06) v1(36.76,21.36) v1(36.76,20.66) v1(36.76,19.96) v1(36.76,19.26) v1(36.76,18.56) v1(36.76,17.86) v1(36.76,17.16) v1(36.76,16.46) v1(36.76,15.76) v1(36.76,15.06) v1(36.76,14.36) v1(36.76,12.96) v1(36.76,12.26) v1(36.76,11.56) v1(36.76,10.86) v1(36.76,10.16) v1(36.76,9.46) v1(36.76,8.76) v1(36.76,8.06) v1(37.46,32.56) v1(37.46,31.86) v1(37.46,31.16) v1(37.46,30.46) v1(37.46,29.76) v1(37.46,29.06) v1(37.46,28.36) v1(37.46,27.66) v1(37.46,26.96) v1(37.46,26.26) v1(37.46,25.56) v1(37.46,24.86) v1(37.46,24.16) v1(37.46,23.46) v1(37.46,22.76) v1(37.46,22.06) v1(37.46,21.36) v1(37.46,20.66) v1(37.46,19.96) v1(37.46,19.26) v1(37.46,18.56) v1(37.46,17.86) v1(37.46,17.16) v1(37.46,16.46) v1(37.46,15.76) v1(37.46,15.06) v1(37.46,14.36) v1(37.46,13.66) v1(37.46,12.96) v1(37.46,12.26) v1(37.46,11.56) v1(37.46,10.86) v1(37.46,10.16) v1(37.46,9.46) v1(38.16,31.86) v1(38.16,31.16) v1(38.16,30.46) v1(38.16,29.76) v1(38.16,29.06) v1(38.16,28.36) v1(38.16,27.66) v1(38.16,26.96) v1(38.16,26.26) v1(38.16,25.56) v1(38.16,24.86) v1(38.16,24.16) v1(38.16,23.46) v1(38.16,22.76) v1(38.16,22.06) v1(38.16,21.36) v1(38.16,20.66) v1(38.16,19.96) v1(38.16,19.26) v1(38.16,18.56) v1(38.16,17.86) v1(38.16,17.16) v1(38.16,16.46) v1(38.16,15.76) v1(38.16,15.06) v1(38.16,14.36) v1(38.16,13.66) v1(38.16,12.96) v1(38.16,12.26) v1(38.16,11.56) v1(38.16,10.86) v1(38.16,10.16) v1(38.86,30.46) v1(38.86,29.76) v1(38.86,29.06) v1(38.86,28.36) v1(38.86,27.66) v1(38.86,26.96) v1(38.86,26.26) v1(38.86,25.56) v1(38.86,24.86) v1(38.86,24.16) v1(38.86,23.46) v1(38.86,22.76) v1(38.86,22.06) v1(38.86,21.36) v1(38.86,20.66) v1(38.86,19.96) v1(38.86,19.26) v1(38.86,18.56) v1(38.86,17.86) v1(38.86,17.16) v1(38.86,16.46) v1(38.86,15.76) v1(38.86,15.06) v1(38.86,14.36) v1(38.86,13.66) v1(38.86,12.96) v1(38.86,12.26) v1(38.86,11.56) v1(39.56,29.06) v1(39.56,28.36) v1(39.56,27.66) v1(39.56,26.96) v1(39.56,26.26) v1(39.56,25.56) v1(39.56,24.86) v1(39.56,24.16) v1(39.56,23.46) v1(39.56,22.76) v1(39.56,22.06) v1(39.56,21.36) v1(39.56,20.66) v1(39.56,19.96) v1(39.56,19.26) v1(39.56,18.56) v1(39.56,17.86) v1(39.56,17.16) v1(39.56,16.46) v1(39.56,15.76) v1(39.56,15.06) v1(39.56,14.36) v1(39.56,13.66) v1(39.56,12.96) v1(40.26,27.66) v1(40.26,26.96) v1(40.26,26.26) v1(40.26,25.56) v1(40.26,24.86) v1(40.26,24.16) v1(40.26,23.46) v1(40.26,22.76) v1(40.26,22.06) v1(40.26,21.36) v1(40.26,20.66) v1(40.26,19.96) v1(40.26,19.26) v1(40.26,18.56) v1(40.26,17.86) v1(40.26,17.16) v1(40.26,16.46) v1(40.26,15.76) v1(40.26,15.06) v1(40.26,14.36) v1(40.96,24.86) v1(40.96,24.16) v1(40.96,23.46) v1(40.96,22.76) v1(40.96,22.06) v1(40.96,21.36) v1(40.96,20.66) v1(40.96,19.96) v1(40.96,19.26) v1(40.96,18.56) v1(40.96,17.86) v1(40.96,17.16)
BAT: length 40.6
  Top Layer w1: NOREF#7.5 2.46,16.4 11.75,7.1 28.37,7.1 v3(32.5,11.24)
  Bottom Layer w1: 32.77,10.97 32.32,11.42 U1.5 ; 32.77,10.97 C7.2 ; 32.77,10.97 C8.2
IO4: length 13.7
  Top Layer w0.254: R1.2 10.21,33.78 8.45,33.78 8.45,32.83 5,29.38 NOREF#13.7
  Bottom Layer w0.254: R1.2 10.21,33.78 R5.1
IO15: length 4
  Bottom Layer w0.5: NOREF#9.5 31.34,28.62 32.44,29.73 32.7,29.73 32.94,29.96 32.94,30.22 R6.1 R7.1
IO16: length 39
  Top Layer w0.254: NOREF#8.1 3.73,25.57 31.16,25.57 33.57,23.16 33.57,19.73 v2(32.94,19.09)
  Bottom Layer w0.254: U1.2 32.88,19.04 v2(32.94,19.09)
IO17: length 36.3
  Top Layer w0.254: v2(32.94,21.76) 33.22,22.04 33.22,23.01 31.01,25.22 7.99,25.22 6.04,23.26 4.57,23.26 3.53,24.3 NOREF#19.2
  Bottom Layer w0.254: U1.1 32.75,21.58 v2(32.94,21.76)
$1N970: length 15.7
  Bottom Layer w0.5: Q1.3 24.98,33.67 24.49,33.67 22.62,35.54 BUZZER1.2
  Bottom Layer w2: 14.41,33.58 19.16,33.58 22.62,37.04
$1N1589: length 10.7
  Bottom Layer w0.5: R6.2 29.91,32.74 29.91,34.18 29.23,34.86 28.26,34.86 27.66,35.47 27.66,35.49 27.42,35.73 26.03,35.73 Q1.1

## Copper pours and planes (outline as drawn; the poured copper is in the pictures)
GND on Top Layer: -6.11,47.8 48.88,47.8 48.88,-4.27 -6.11,-4.27
GND on Bottom Layer: -5.16,47.16 49.83,47.16 49.83,-4.91 -5.16,-4.91
